# EAGLE design app_jalousie_up_v0_^2 (EAGLE 5.04)
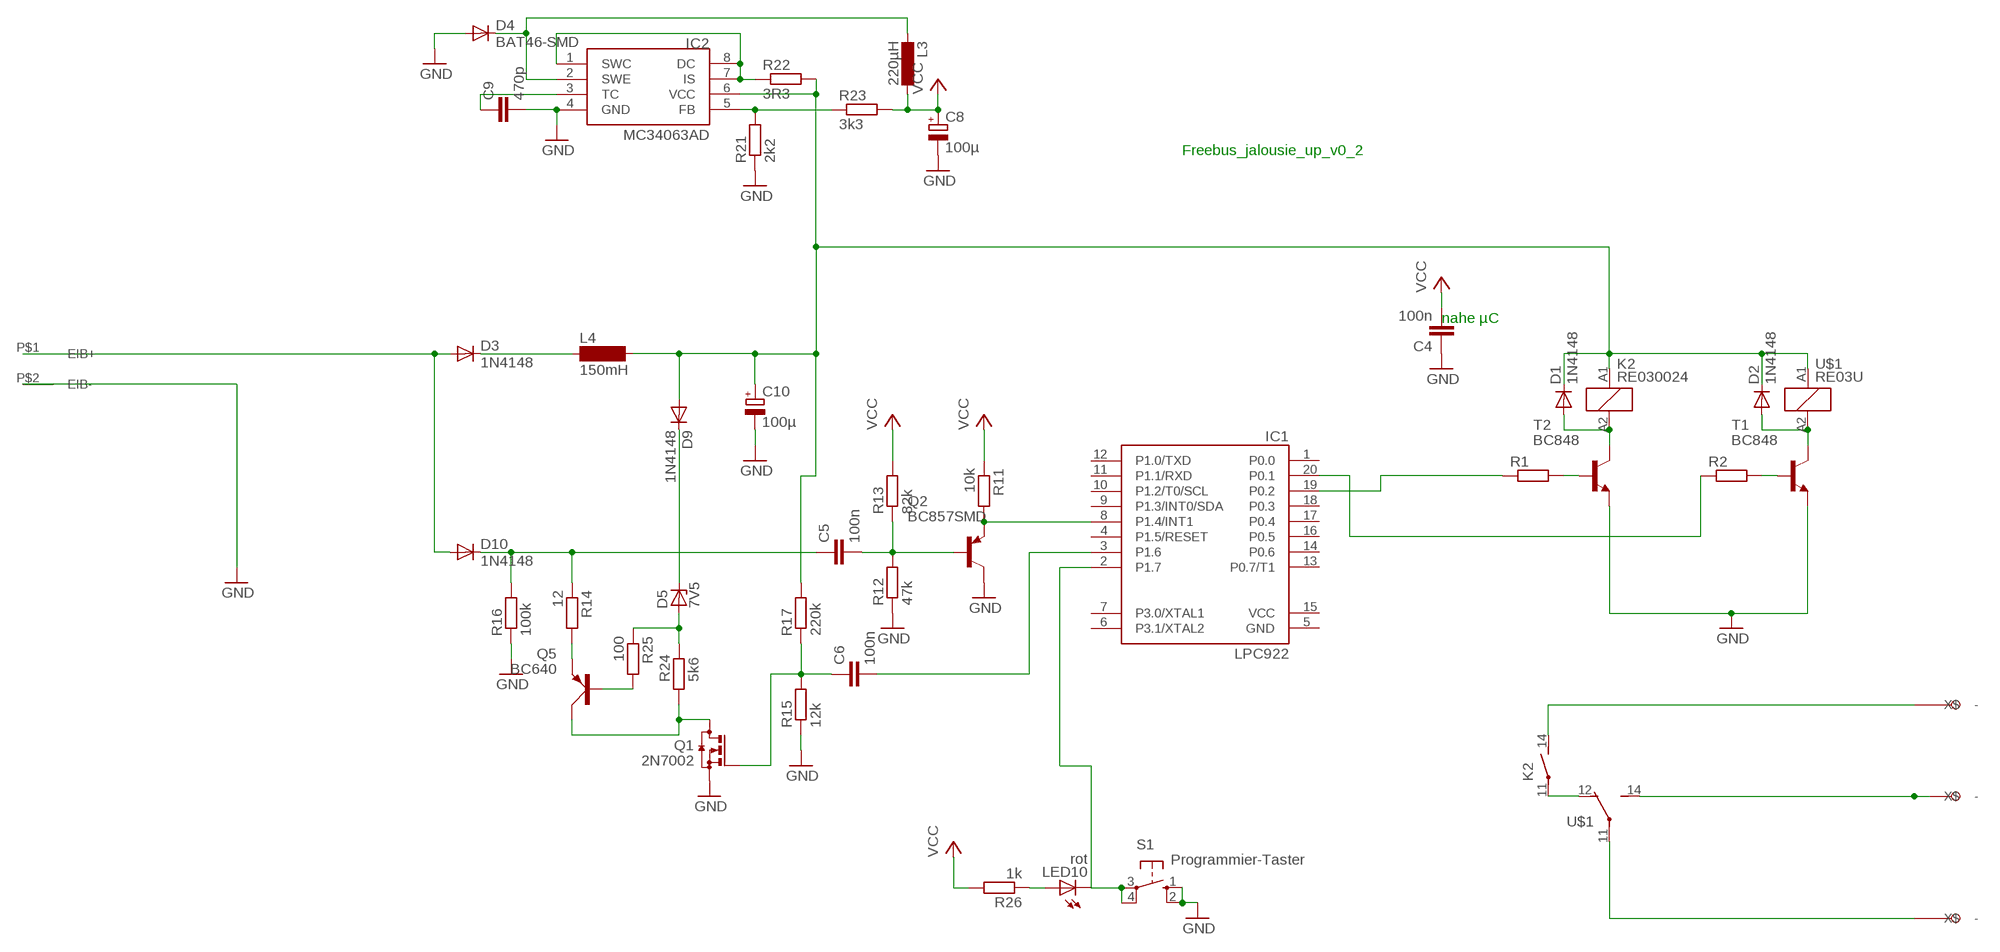
[diagram p0: schematic, sheet 1]

## Parts
C4  100n  C-EUC0805  [C0805]
C5  100n  C-EUC0603K  [C0603K]
C6  100n  C-EUC0603K  [C0603K]
C8  100µ  CPOL-EUE2.5-6  [E2,5-6]
C9  470p  C-EUC0603K  [C0603K]
C10  100µ  CPOL-EUE5-8.5  [E5-8,5]
D1  1N4148  DIODE-SOD80C  [SOD80C]
D2  1N4148  DIODE-SOD80C  [SOD80C]
D3  1N4148  DIODE-SOD80C  [SOD80C]
D4  BAT46-SMD  DIODE-SOD80C  [SOD80C]
D5  7V5  ZENER-DIODESOD80C  [SOD80C]
D9  1N4148  DIODE-SOD80C  [SOD80C]
D10  1N4148  DIODE-SOD80C  [SOD80C]
DOWN  SCHRAUBKLEMME  [SCHRAUBKLEMME_PAC]
IC1  LPC922  [TSSOP20]
IC2  MC34063AD  [SOIC8]
K2  RE030024  [RE-SCHRACK]
L1  SCHRAUBKLEMME  [SCHRAUBKLEMME_PAC]
L3  220µH  L-EU0207/2V  [0207/2V]
L4  150mH  SD12-1000  [SD12_1000]
LED10  rot  LED3MM  [LED3MM]
Q1  2N7002  BSS123  [SOT23]
Q2  BC857SMD  BC857ALT1SMD  [SOT23-BEC]
Q5  BC640  [SOT54D]
R1  R-EU_M0805  [M0805]
R2  R-EU_M0805  [M0805]
R11  10k  R-EU_R0805  [R0805]
R12  47k  R-EU_R0805  [R0805]
R13  82k  R-EU_R0805  [R0805]
R14  12  R-EU_R0805  [R0805]
R15  12k  R-EU_R0805  [R0805]
R16  100k  R-EU_R0805  [R0805]
R17  220k  R-EU_R0805  [R0805]
R21  2k2  R-EU_R0805  [R0805]
R22  3R3  R-EU_R0805  [R0805]
R23  3k3  R-EU_R0805  [R0805]
R24  5k6  R-EU_R0805  [R0805]
R25  100  R-EU_R0805  [R0805]
R26  1k  R-EU_R0805  [R0805]
S1  Programmier-Taster  10-XX  [B3F-10XX]
T1  BC848  [SOT23]
T2  BC848  [SOT23]
U$1  RE03U  [G5Q_1_EU]
U$3  BUSKLEMME  [BUSKLEMME]
UP  SCHRAUBKLEMME  [SCHRAUBKLEMME_PAC]

## Nets
GND: C4.1 C8.- C9.2 C10.- D4.A IC2.4(GND) Q1.2(S) Q2.C R12.1 R15.1 R16.1 R21.1 S1.1(S) S1.2(S1) T1.2(E) T2.2(E) U$3.P$2(EIB-)
N$1: K2.11(2:P) U$1.12(14:O)
N$2: L1.P$2(-) U$1.11(14:P)
N$3: DOWN.P$2(-) K2.14(2:S)
N$4: U$1.14(14:S) UP.P$1(X$) UP.P$2(-)
N$5: C10.+ D1.C D2.C D9.A IC2.6(VCC) K2.A1 L4.2 R17.2 R22.2 U$1.A1
N$6: D2.A T1.3(C) U$1.A2
N$7: R2.2 T1.1(B)
N$8: R1.2 T2.1(B)
N$9: D1.A K2.A2 T2.3(C)
N$10: IC1.19(P0.2) R1.1
N$14: IC1.8(P1.4/INT1) Q2.E R11.2
N$17: IC1.2(P1.7) LED10.K(C) S1.3(P) S1.4(P1)
N$19: IC1.20(P0.1) R2.1
N$21: D3.A D10.A U$3.P$1(EIB+)
N$22: C5.2 Q2.B R12.2 R13.1
N$23: C6.2 IC1.3(P1.6)
N$24: C5.1 D10.C R14.1 R16.2
N$27: IC2.5(FB) R21.2 R23.1
N$28: IC2.1(SWC) IC2.7(IS) IC2.8(DC) R22.1
N$34: C6.1 Q1.1(G) R15.2 R17.1
N$36: D4.C IC2.2(SWE) L3.2
N$37: C9.1 IC2.3(TC)
N$39: D3.C L4.1
N$40: Q1.3(D) Q5.C R24.1
N$41: D5.A R24.2 R25.1
N$42: Q5.E R14.2
N$43: Q5.B R25.2
N$61: D5.C D9.C
N$62: LED10.A R26.1
VCC: C4.2 C8.+ L3.1 R11.1 R13.2 R23.2 R26.2
Unconnected: DOWN.P$1(X$) IC1.1(P0.0) IC1.4(P1.5/RESET) IC1.6(P3.1/XTAL2) IC1.7(P3.0/XTAL1) IC1.9(P1.3/INT0/SDA) IC1.10(P1.2/T0/SCL) IC1.11(P1.1/RXD) IC1.12(P1.0/TXD) IC1.13(P0.7/T1) IC1.14(P0.6) IC1.16(P0.5) IC1.17(P0.4) IC1.18(P0.3) L1.P$1(X$)

## Notes on the sheet
- Freebus_jalousie_up_v0_2
- nahe µC

## Power pins joined to a net without a drawn wire
GND: IC1.5(GND)
VCC: IC1.15(VCC)

## Library data of the parts
C4-C6 C9 = rcl:C-EU: CAPACITOR, European symbol
C8 C10 = rcl:CPOL-EU: POLARIZED CAPACITOR, European symbol
D1-D4 D9 D10 = diode:DIODE-: DIODE
D5 = diode:ZENER-DIODE: Z-Diode
DOWN L1 UP = freebus:SCHRAUBKLEMME
IC1 = Philips:LPC922
IC2 = mc34063:MC34063
K2 = relay:RE03*: Miniature PCB Relay 1 pole 6 A SCHRACK Source: http://www.schrack.com/.. 5812.pdf
L3 = rcl:L-EU: INDUCTOR, European symbol
L4 = inductor-neosid:SD12: INDUCTOR nominal inductance
LED10 = led:LED: LED OSRAM: - CHIPLED LG R971, LG N971, LY N971, LG Q971, LY Q971, LO R971, LY R971 LH N974, LH R974 LS Q976, LO Q976, LY Q976 LO Q996 - Hyper CHIPLED LW Q18S LB Q993, LB Q99A, LB R99A - SideLED LS A670, LO A670, LY A670, LG A670, LP A670 LB A673, LV A673, LT A673, LW A673 LH A674 LY A675 LS A676, LA A676, LO A676, LY A676, LW A676 LS A679, LY A679, LG A679 - Hyper Micro SIDELED® LS Y876, LA Y876, LO Y876, LY Y876 LT Y87S - SmartLED LW L88C, LW L88S LB L89C, LB L89S, LG L890 LS L89K, LO L89K, LY L89K LS L896, LA L896, LO L896, LY L896 - TOPLED LS T670, LO T670, LY T670, LG T670, LP T670 LSG T670, LSP T670, LSY T670, LOP T670, LYG T670 LG T671, LOG T671, LSG T671 LB T673, LV T673, LT T673, LW T673 LH T674 LS T676, LA T676, LO T676, LY T676, LB T676, LH T676, LSB T676, LW T676 LB T67C, LV T67C, LT T67C, LS T67K, LO T67K, LY T67K, LW E67C LS E67B, LA E67B, LO E67B, LY E67B, LB E67C, LV E67C, LT E67C LW T67C LS T679, LY T679, LG T679 LS T770, LO T770, LY T770, LG T770, LP T770 LB T773, LV T773, LT T773, LW T773 LH T774 LS E675, LA E675, LY E675, LS T675 LS T776, LA T776, LO T776, LY T776, LB T776 LHGB T686 LT T68C, LB T68C - Hyper Mini TOPLED® LB M676 - Mini TOPLED Santana® LG M470 LS M47K, LO M47K, LY M47K Source: http://www.osram.convergy.de - LUMILED® LXK2-PW12-R00, LXK2-PW12-S00, LXK2-PW14-U00, LXK2-PW14-V00 LXK2-PM12-R00, LXK2-PM12-S00, LXK2-PM14-U00 LXK2-PE12-Q00, LXK2-PE12-R00, LXK2-PE12-S00, LXK2-PE14-T00, LXK2-PE14-U00 LXK2-PB12-K00, LXK2-PB12-L00, LXK2-PB12-M00, LXK2-PB14-N00, LXK2-PB14-P00, LXK2-PB14-Q00 LXK2-PR12-L00, LXK2-PR12-M00, LXK2-PR14-Q00, LXK2-PR14-R00 LXK2-PD12-Q00, LXK2-PD12-R00, LXK2-PD12-S00 LXK2-PH12-R00, LXK2-PH12-S00 LXK2-PL12-P00, LXK2-PL12-Q00, LXK2-PL12-R00 Source: www.luxeon.com
Q1 = transistor-small-signal:BSS123: N-CHANNEL MOS FET
Q2 = transistor-pnp:BC857*: PNP Transistror
Q5 = transistor-small-signal:BC640: PNP TRANSISTOR
R1 R2 R11-R17 R21-R26 = rcl:R-EU_: RESISTOR, European symbol
S1 = switch-omron:10-XX: OMRON SWITCH
T1 T2 = transistor:BC848: NPN TRANSISTOR
U$1 = freebus_relay:RE03U
U$3 = freebus:BUSKLEMME

## Board
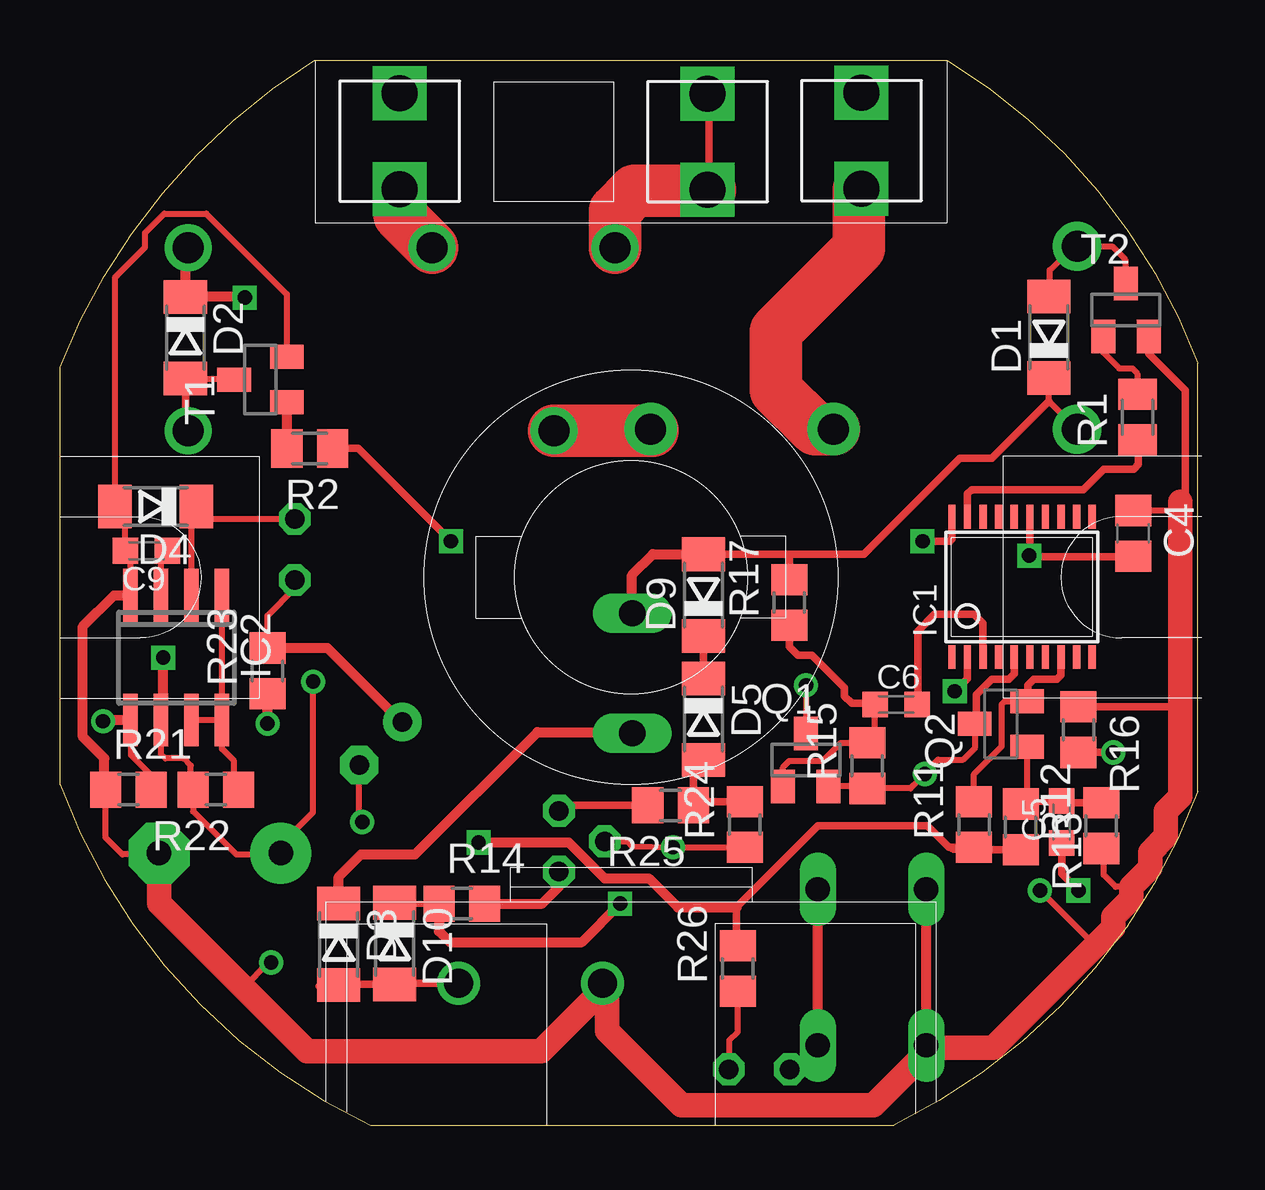
[diagram p1: board, top side]
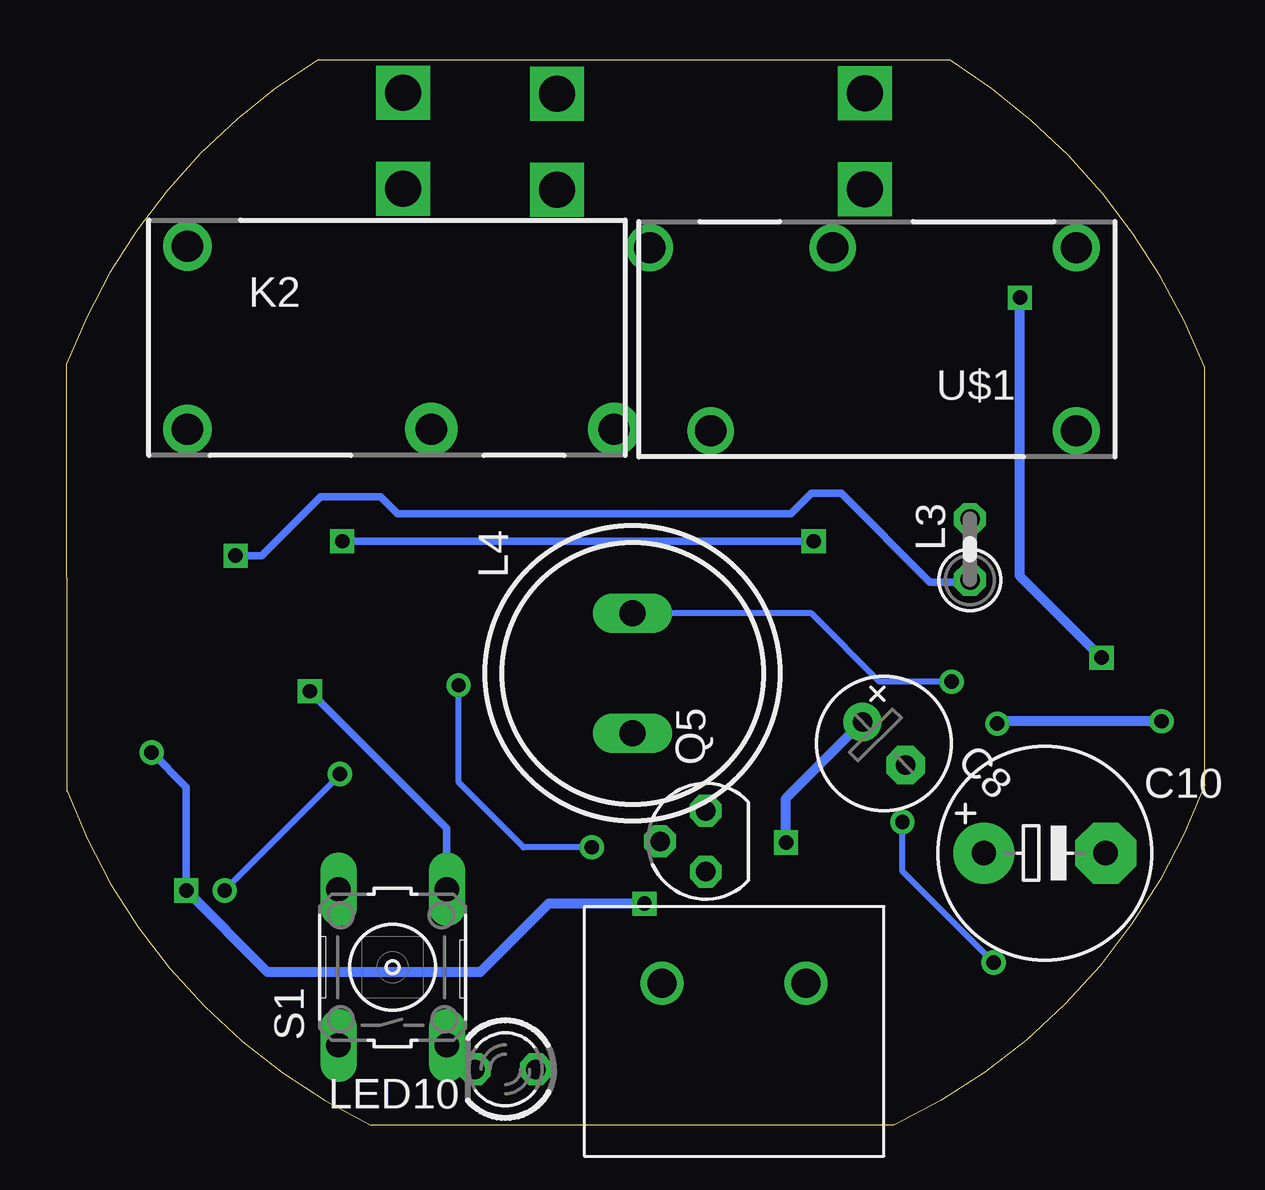
[diagram p2: board, bottom side, seen from below]

Size 47.43 x 44.38 mm. Coordinates in mm from the lower left corner, seen from the top.
Outline: 10.62,44.38 36.96,44.38
Outline: 47.42,13.9 47.43,31.75
Outline: 12.95,0 34.75,0
Outline: 12.95,0 arc-44 0,14.19 0,31.58 arc-36 10.61,44.38
Outline: 36.98,44.38 arc-38 47.43,31.76
Outline: 47.42,13.91 arc-44 34.75,0
Copper layers (1*16): Top 0.035mm / dielectric 1.5mm / Bottom 0.035mm
Design rules "default": minimum track width 10mil, minimum drill 24mil, track to track 8mil, track to pad 8mil, pad to pad 8mil, via to via 8mil, smd to smd 8mil, copper to edge 40mil, drill to drill 8mil, minimum pad ring 10mil, minimum via ring 8mil, stop-mask expansion 4mil, vias tented up to drill 0mil, thermal gap 10mil

### Footprints (pad centres in the part's own frame; a part is rotated, then mirrored left to right if it is on the bottom)
C0805 = smd 1.3 x 1.5: 1 -0.95,0; 2 0.95,0
C0603K = smd 1.05 x 1.08: 1 -0.875,0; 2 0.875,0
E2,5-6 = drill 0.813 pad 1.6 round: + -1.27,0 | drill 0.813 pad 1.6 octagon: - 1.27,0
E5-8,5 = drill 1.016 pad 2.54 round: + -2.54,0 | drill 1.016 pad 2.54 octagon: - 2.54,0
SOD80C = smd 1.4 x 1.8: A 1.7,0; C -1.7,0
SCHRAUBKLEMME_PAC = drill 1.5 pad 1.93 square: P$1 -2,0; P$2 2,0
TSSOP20 = smd 0.305 x 0.991: 1 -2.925,-2.918; 2 -2.275,-2.918; 3 -1.625,-2.918; 4 -0.975,-2.918; 5 -0.325,-2.918; 6 0.325,-2.918; 7 0.975,-2.918; 8 1.625,-2.918; 9 2.275,-2.918; 10 2.925,-2.918; 11 2.925,2.918; 12 2.275,2.918; 13 1.625,2.918; 14 0.975,2.918; 15 0.325,2.918; 16 -0.325,2.918; 17 -0.975,2.918; 18 -1.625,2.918; 19 -2.275,2.918; 20 -2.925,2.918
SOIC8 = smd 0.6 x 2.2: 1 -1.905,-2.6; 2 -0.635,-2.6; 3 0.635,-2.6; 4 1.905,-2.6; 5 1.905,2.6; 6 0.635,2.6; 7 -0.635,2.6; 8 -1.905,2.6
RE-SCHRACK = drill 1.3 pad 2.184 round: 11 8.89,-3.81; 14 1.27,-3.81 | drill 1.3 pad 2.032 round: A1 -8.89,-3.81; A2 -8.89,3.81
0207/2V = drill 0.813 octagon: 1 -1.27,0; 2 1.27,0
SD12_1000 = drill 1.1 long: 1 -2.5,0; 2 2.5,0
LED3MM = drill 0.813 octagon: A -1.27,0; K 1.27,0
SOT23 = smd 1 x 1.4: 1 -0.95,-1.1; 2 0.95,-1.1; 3 0,1.1
SOT23-BEC = smd 1 x 1.4: B -0.95,-1.1; C 0,1.1; E 0.95,-1.1
SOT54D = drill 0.813 octagon: B 1.27,0; C 0,1.905; E -1.27,0
M0805 = smd 1.3 x 1.6: 1 -0.95,0; 2 0.95,0
R0805 = smd 1.3 x 1.5: 1 -0.95,0; 2 0.95,0
B3F-10XX = drill 1.016 long: 1 -3.251,2.261; 2 3.251,2.261; 3 -3.251,-2.261; 4 3.251,-2.261
G5Q_1_EU = drill 1.3 round: 11 1.27,-3.81; 12 6.35,3.81; 14 8.89,-3.81; A1 -8.89,-3.81; A2 -8.89,3.81
BUSKLEMME = drill 1.2 pad 1.676 round: P$1 0,0; P$2 6,0

### Placement (x,y rotation side)
C4  44.73,24.66 270 top
C5  41.75,12.63 90 top
C6  34.85,17.53 0 top
C8  13.37,15.91 315 bottom
C9  3.6,23.93 180 top
C10  6.67,11.34 0 bottom
D1  41.22,32.83 90 top
D2  5.23,32.81 270 top
D3  11.62,7.54 270 top
D4  3.99,25.78 180 top
D5  26.82,16.92 270 top
D9  26.82,22.09 90 top
D10  13.95,7.57 270 top
DOWN  33.41,41.02 270 top
IC1  40.1,22.43 0 top
IC2  4.85,19.48 180 top
K2  33.51,32.81 0 bottom
L1  14.16,41 270 top
L3  9.79,23.99 90 bottom
L4  23.85,18.83 90 bottom
LED10  29.15,2.33 180 bottom
Q1  31.09,15.22 0 top
Q2  39.22,16.72 90 top
Q5  20.8,11.83 90 bottom
R1  44.92,29.5 90 top
R2  10.41,28.2 180 top
R11  38.1,12.53 90 top
R12  43.4,12.48 90 top
R13  40.05,12.43 270 top
R14  16.75,9.23 0 top
R15  33.65,14.98 90 top
R16  42.45,16.48 270 top
R17  30.4,21.78 90 top
R21  2.85,13.98 0 top
R22  6.5,13.98 180 top
R23  8.65,18.93 90 top
R24  28.55,12.53 90 top
R25  25.45,13.33 180 top
R26  28.25,6.53 90 top
S1  33.85,6.58 90 bottom
T1  8.36,31.07 90 top
T2  44.43,33.97 0 top
U$1  14.24,32.75 180 bottom
U$3  16.62,5.91 180 bottom
UP  26.99,40.98 90 top

### Tracks (layer width: path | path; a pad name or v marks a point on that pad's centre or on a via)
GND  (via drill 0.6)
  Top 0.254: T1.2 9.45,34.63 6.1,37.98 4.35,37.98 3.55,37.18 3.55,36.58 2.3,35.33 2.3,25.88 2.25,25.83 D4.A 2.4,25.78 2.73,25.46 C9.2 2.7,23.93 2.94,23.69 IC2.4 | 1.85,13.78 1.9,13.83 R21.1 1.9,11.98 2.6,11.28 3.9,11.28 3.96,11.34 C10.- | 46.7,25.73 46.6,25.73 46.48,25.61 C4.1 | 44.65,9.93 44,9.93 43.5,10.43 43.5,11.58 43.4,11.68 R12.1 | 37.95,16.74 38.05,16.63 38.12,16.7 Q2.C 38.15,16.68 38.15,15.73 37.65,15.23 36.6,15.23 35.8,14.43 35.8,14.38 35.45,14.03 | Q1.2 33.66,14.12 33.7,14.08 R15.1 35.45,14.03 | v36.05,14.63 35.45,14.03 | 43.15,7.48 v40.85,9.78 | C8.- 12.47,12.76 v12.6,12.63 | v8.8,6.78 8.7,6.78 7.65,5.73
  Top 0.305: T2.2 45.38,32.15 46.9,30.63 46.9,26.18 46.7,25.98 | R16.1 46.6,17.43 46.7,17.53 | IC1.5 39.77,18.81 39.55,18.58 38.85,18.58 38.2,17.93 38.2,16.8 Q2.C
  Top 0.406: S1.1 36.11,3.52 36.1,3.53 36.11,3.54 S1.2 | IC2.4 2.25,22.08 0.95,20.78 0.95,16.18 1.85,15.28 1.85,14.13 1.9,14.08 R21.1
  Top 1.016: C10.- 4.13,9.26 7.65,5.73 10.3,3.08 20.05,3.08 22.8,5.83 | 22.8,5.83 22.72,5.91 U$3.P$2 | 22.8,5.83 22.8,3.93 25.9,0.83 33.9,0.83 36.11,3.04 S1.1 36.05,3.33 36,3.28 36.05,3.23 38.9,3.23 43.15,7.48 43.9,8.23 43.9,8.68 44.65,9.43 44.65,9.93 45.45,10.73 45.45,11.38 46.1,12.03 46.1,13.08 46.7,13.68 46.7,17.53 46.7,25.73 46.7,25.98
  Bottom 0.254: v36.05,14.63 36.05,14.58 v40.85,9.78 | v12.6,12.63 12.6,10.58 v8.8,6.78
N$1
  Top 2.184: 24.69,28.94 K2.11 | U$1.12 24.69,28.94 | 24.69,28.94 24.7,28.93
N$2
  Top 2.184: U$1.11 14.16,37.92 L1.P$2
N$3
  Top 2.184: 32.27,29 K2.14 31.48,29 29.85,30.63 29.85,33.08 33.3,36.53 33.3,38.98 33.35,39.03 33.36,39.02 DOWN.P$2
N$4
  Top 0.305: UP.P$1 26.99,38.89 27.05,38.83 27.05,42.92 UP.P$2
  Top 2.184: U$1.14 23.13,38.11 23.95,38.93 27.05,38.93 27.1,38.98 UP.P$1
N$5  (via drill 0.6)
  Top 0.254: K2.A1 42.4,28.98 41.22,30.16 D1.C | IC2.6 4.21,15.47 4.4,15.28 5.15,15.28 5.45,14.98 5.45,14.23 5.55,14.13 R22.2 5.55,13.08 7.35,11.28 8.95,11.28 9,11.23 9.11,11.34 C10.+ 9.21,11.69 10.55,13.03 v10.55,18.48
  Top 0.305: 30.4,23.78 R17.2 | D9.A 30.39,23.79 30.4,23.78 | 36.1,26.38 35.8,26.08 | 36.1,26.38 37.5,27.78 38.84,27.78 41.22,30.16 | 30.4,23.78 33.5,23.78 36.1,26.38
  Top 0.406: v7.7,34.48 7.67,34.51 D2.C 5.23,36.56 U$1.A1 | IC2.6 4.3,16.88 v4.3,19.48 | D9.A 24.71,23.79 23.85,22.93 L4.2
  Bottom 0.254: v10.55,18.48 13.55,18.48 16.4,21.33 24.05,21.33 | 24.05,21.33 L4.2 | 24.05,21.33 24.1,21.38
  Bottom 0.406: v7.7,34.48 7.7,22.88 v4.3,19.48
N$6
  Top 0.254: T1.3 7.21,31.07 7.15,31.13 7.13,31.11 D2.A
  Top 0.305: U$1.A2 5.35,29.03 5.23,29.15 D2.A
N$7
  Top 0.406: R2.2 T1.1
N$8
  Top 0.254: T2.1 43.48,32.2 44.15,31.53 44.7,31.53 44.9,31.33 44.9,30.43 R1.2
N$9
  Top 0.254: D1.A 41.25,34.53 41.25,35.63 42.24,36.62 K2.A2 43.86,36.62 44.4,36.08 44.4,35.28 44.43,35.25 T2.3
N$10
  Top 0.305: IC1.19 37.82,26.31 38,26.48 42.65,26.48 43.5,27.33 44.75,27.33 44.95,27.53 44.95,28.52 R1.1
N$14
  Top 0.254: 39.89,17.79 40.01,17.67 Q2.E 39.39,17.67 39.25,17.53 39.25,15.78 38.1,14.63 R11.2 38.1,13.43
  Top 0.305: IC1.8 41.73,18.76 41.55,18.58 40.6,18.58 40.35,18.33 40.35,17.7 Q2.E
N$17  (via drill 0.6)
  Top 0.305: IC1.2 37.82,18.61 v37.3,18.08
  Top 0.406: LED10.K 30.65,2.33 31.59,3.27 S1.3 31.6,3.33 | 31.6,3.33 31.65,3.28 | S1.4 S1.3 31.6,3.33
  Bottom 0.305: v37.3,18.08 31.6,12.38 31.6,9.84 S1.4
N$19  (via drill 0.6)
  Top 0.305: R2.1 12.43,28.2 v16.3,24.33 | IC1.20 37.17,24.41 37.1,24.33 v35.95,24.33
  Bottom 0.305: v16.3,24.33 v35.95,24.33
N$21
  Top 0.305: 13.82,5.91 13.86,5.87 D10.A 10.89,5.87 10.86,5.84 | 13.82,5.91 U$3.P$1 | 13.82,5.91 13.8,5.93 | 10.86,5.84 10.8,5.78 | 10.86,5.84 D3.A
N$22
  Top 0.254: 40.15,13.38 40.25,13.38 40.3,13.33 40.32,13.35 Q2.B | R13.1 40.15,13.38 | 41.7,13.48 40.25,13.48 40.15,13.38
  Top 0.305: C5.2 41.73,13.51 41.7,13.48 41.75,13.43 R12.2
N$23
  Top 0.305: IC1.3 38.48,20.91 38.1,21.28 36.45,21.28 35.75,20.58 35.75,17.56 C6.2
N$24  (via drill 0.6)
  Top 0.254: D10.C 14.11,9.27 14.15,9.23 R14.1
  Top 0.305: C5.1 41.75,10.48 v42.45,9.78 | v43.9,15.53 R16.2
  Top 0.406: R14.1 15.8,8.08 16.25,7.63 21.75,7.63 v23.35,9.23
  Bottom 0.305: v42.45,9.78 42.45,14.08 v43.9,15.53
  Bottom 0.406: v23.35,9.23 27.35,9.23 30.2,6.38 39.05,6.38 v42.45,9.78
N$27  (via drill 0.6)
  Top 0.254: R21.2 3.8,14.58 2.95,15.43 2.95,16.83 2.9,16.88 | 2.9,16.88 2.85,16.93 | IC2.5 2.9,16.88
  Top 0.406: IC2.5 1.85,16.88 v1.8,16.83 | R23.1 8.7,17.93 8.65,17.88 v8.65,16.73
  Bottom 0.406: v1.8,16.83 8.55,16.83 v8.65,16.73
N$28
  Top 0.254: IC2.8 6.7,16.88 6.65,16.83 6.6,16.88 IC2.7 | IC2.8 6.76,15.68 7.25,15.18 7.25,14.03 7.3,13.98 R22.1 | IC2.8 6.76,16.78 | 6.76,16.78 IC2.1 | 6.76,16.78 6.85,16.68
N$34
  Top 0.254: C6.1 33.98,16.26 R15.2 33.8,15.93 | Q1.1 30.14,14.92 30.4,15.18 31.8,15.18 32.55,15.93 33.8,15.93 | 33.8,15.93 33.85,15.98
  Top 0.305: R17.1 30.4,19.93 30.75,19.58 31.35,19.58 32.7,18.23 32.7,17.88 33,17.58 33.92,17.58 C6.1
N$36
  Top 0.254: L3.2 5.72,25.26 5.65,25.33 5.69,25.37 D4.C 5.65,25.78 5.48,25.62 IC2.2
N$37
  Top 0.254: C9.1 4.4,23.93 4.3,24.03 4.21,23.95 IC2.3
N$39
  Top 0.406: D3.C 11.62,10.35 12.55,11.28 14.8,11.28 19.9,16.38 23.8,16.38 L4.1
N$40  (via drill 0.6)
  Top 0.254: R24.1 v25.55,11.58 23.85,11.63 23.65,11.83 Q5.C | Q1.3 31.1,16.43 v31.1,18.33
  Bottom 0.254: v25.55,11.58 28.4,11.58 31.1,14.28 v31.1,18.33
N$41
  Top 0.305: R24.2 26.55,13.48 R25.1 26.4,14.8 D5.A
N$42
  Top 0.406: Q5.E 20.8,9.93 20.1,9.23 R14.2
N$43
  Top 0.305: R25.2 21.03,13.33 Q5.B
N$61
  Top 0.305: D5.C D9.C
N$62
  Top 0.254: R26.1 28.25,3.88 27.9,3.53 27.9,2.33 | LED10.A 27.9,2.33 | 27.9,2.33 28.05,2.18
VCC  (via drill 0.6)
  Top 0.254: L3.1 9.79,22.37 8.65,21.23 R23.2 8.65,19.78 | 36.15,12.48 36.2,12.48 37.2,11.48 38.15,11.48 38.25,11.58
  Top 0.305: R13.2 38.2,11.48 R11.1 37.05,11.58 36.15,12.48 31.6,12.48 28.2,9.08 28.2,7.53 R26.2 | C4.2 44.7,23.68 40.45,23.68 v40.4,23.73 40.42,23.76 IC1.15
  Top 0.406: 14.27,16.77 14.45,16.58 | C8.+ 14.27,16.77 | R23.2 11.15,19.88 14.27,16.77 | 28.2,9.08 25.75,9.08 24.55,10.28 22.7,10.28 21.2,11.78 v17.45,11.78
  Bottom 0.305: v40.4,23.73 39.3,23.73 36.85,26.18 34.35,26.18 33.65,25.48 17.25,25.48 16.4,26.33 15.15,26.33 11.45,22.63 9.88,22.63 L3.1
  Bottom 0.406: v17.45,11.78 17.45,13.62 C8.+